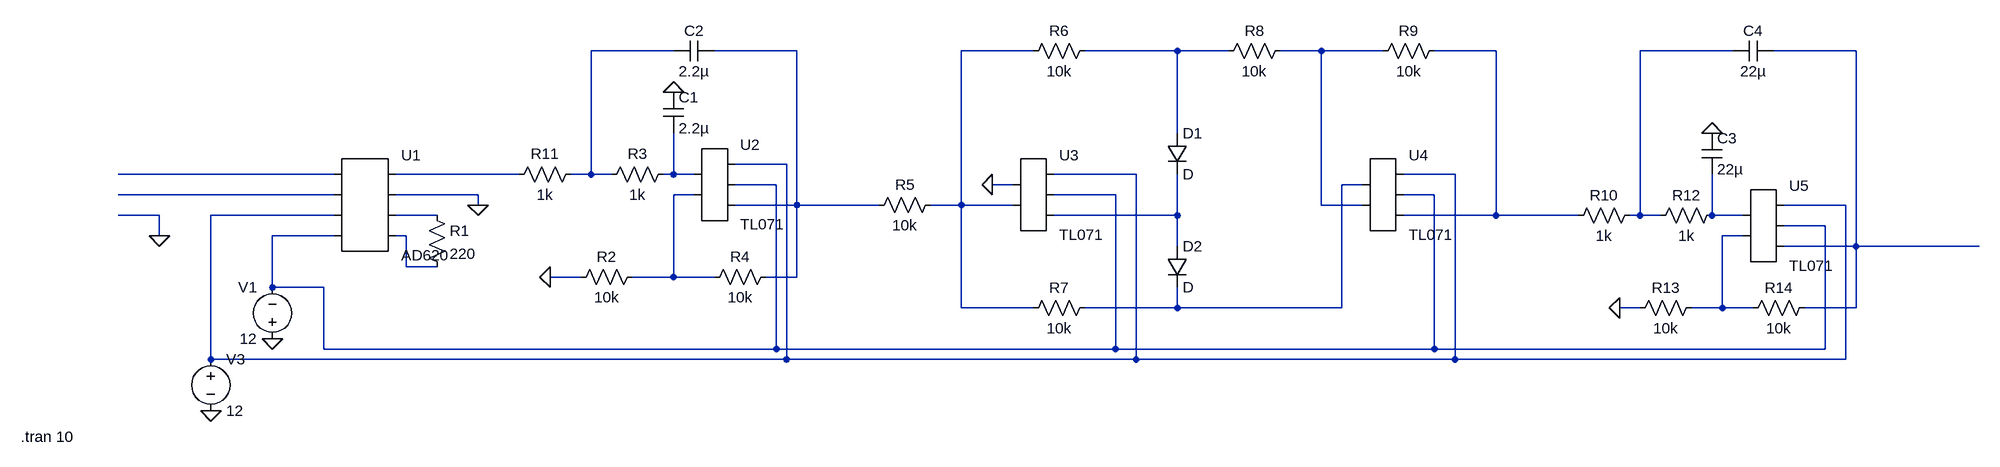
[diagram p0: schematic circuit.asc]
circuit.asc, the LTspice schematic file:
Version 4
SHEET 1 3044 680
WIRE 912 -144 784 -144
WIRE 1104 -144 976 -144
WIRE 1472 -144 1360 -144
WIRE 1696 -144 1552 -144
WIRE 1776 -144 1696 -144
WIRE 1920 -144 1856 -144
WIRE 2016 -144 1920 -144
WIRE 2192 -144 2096 -144
WIRE 2560 -144 2416 -144
WIRE 2752 -144 2624 -144
WIRE 1696 -16 1696 -144
WIRE 1088 32 1008 32
WIRE 384 48 48 48
WIRE 672 48 480 48
WIRE 784 48 784 -144
WIRE 784 48 752 48
WIRE 816 48 784 48
WIRE 912 48 912 -16
WIRE 912 48 896 48
WIRE 944 48 912 48
WIRE 1632 48 1504 48
WIRE 2128 48 2048 48
WIRE 1072 64 1008 64
WIRE 1440 64 1408 64
WIRE 1984 64 1952 64
WIRE 384 80 48 80
WIRE 608 80 480 80
WIRE 944 80 912 80
WIRE 1600 80 1504 80
WIRE 2096 80 2048 80
WIRE 608 96 608 80
WIRE 1104 96 1104 -144
WIRE 1104 96 1008 96
WIRE 1232 96 1104 96
WIRE 1360 96 1360 -144
WIRE 1360 96 1312 96
WIRE 1440 96 1360 96
WIRE 1920 96 1920 -144
WIRE 1984 96 1920 96
WIRE 2736 96 2640 96
WIRE 112 112 48 112
WIRE 384 112 192 112
WIRE 544 112 480 112
WIRE 1696 112 1696 48
WIRE 1696 112 1504 112
WIRE 2192 112 2192 -144
WIRE 2192 112 2048 112
WIRE 2320 112 2192 112
WIRE 2416 112 2416 -144
WIRE 2416 112 2400 112
WIRE 2448 112 2416 112
WIRE 2528 112 2528 48
WIRE 2576 112 2528 112
WIRE 2704 128 2640 128
WIRE 112 144 112 112
WIRE 384 144 288 144
WIRE 496 144 480 144
WIRE 2576 144 2544 144
WIRE 1696 160 1696 112
WIRE 2752 160 2752 -144
WIRE 2752 160 2640 160
WIRE 2944 160 2752 160
WIRE 496 192 496 144
WIRE 544 192 496 192
WIRE 768 208 720 208
WIRE 912 208 912 80
WIRE 912 208 848 208
WIRE 976 208 912 208
WIRE 1104 208 1104 96
WIRE 1104 208 1056 208
WIRE 288 224 288 144
WIRE 368 224 288 224
WIRE 1360 256 1360 96
WIRE 1472 256 1360 256
WIRE 1696 256 1696 224
WIRE 1696 256 1552 256
WIRE 1952 256 1952 64
WIRE 1952 256 1696 256
WIRE 2416 256 2384 256
WIRE 2544 256 2544 144
WIRE 2544 256 2496 256
WIRE 2592 256 2544 256
WIRE 2752 256 2752 160
WIRE 2752 256 2672 256
WIRE 368 320 368 224
WIRE 1072 320 1072 64
WIRE 1072 320 368 320
WIRE 1600 320 1600 80
WIRE 1600 320 1072 320
WIRE 2096 320 2096 80
WIRE 2096 320 1600 320
WIRE 2704 320 2704 128
WIRE 2704 320 2096 320
WIRE 192 336 192 112
WIRE 1088 336 1088 32
WIRE 1088 336 192 336
WIRE 1632 336 1632 48
WIRE 1632 336 1088 336
WIRE 2128 336 2128 48
WIRE 2128 336 1632 336
WIRE 2736 336 2736 96
WIRE 2736 336 2128 336
FLAG 608 96 0
FLAG 288 304 0
FLAG 192 416 0
FLAG 912 -80 0
FLAG 720 208 0
FLAG 1408 64 0
FLAG 2528 -16 0
FLAG 2384 256 0
FLAG 112 144 0
SYMBOL AutoGenerated\\AD620 432 96 R0
SYMATTR InstName U1
SYMBOL res 528 96 R0
SYMATTR InstName R1
SYMATTR Value 220
SYMBOL voltage 288 320 R180
WINDOW 0 24 96 Left 2
WINDOW 3 24 16 Left 2
WINDOW 123 0 0 Left 0
WINDOW 39 0 0 Left 0
SYMATTR InstName V1
SYMATTR Value 12
SYMBOL voltage 192 320 R0
WINDOW 123 0 0 Left 0
WINDOW 39 0 0 Left 0
SYMATTR InstName V3
SYMATTR Value 12
SYMBOL cap 896 -80 R0
SYMATTR InstName C1
SYMATTR Value 2.2µ
SYMBOL res 768 32 R90
WINDOW 0 0 56 VBottom 2
WINDOW 3 32 56 VTop 2
SYMATTR InstName R11
SYMATTR Value 1k
SYMBOL AutoGenerated\\TL071 976 64 R0
SYMATTR InstName U2
SYMBOL res 864 192 R90
WINDOW 0 0 56 VBottom 2
WINDOW 3 32 56 VTop 2
SYMATTR InstName R2
SYMATTR Value 10k
SYMBOL res 1072 192 R90
WINDOW 0 0 56 VBottom 2
WINDOW 3 32 56 VTop 2
SYMATTR InstName R4
SYMATTR Value 10k
SYMBOL res 912 32 R90
WINDOW 0 0 56 VBottom 2
WINDOW 3 32 56 VTop 2
SYMATTR InstName R3
SYMATTR Value 1k
SYMBOL cap 976 -160 R90
WINDOW 0 0 32 VBottom 2
WINDOW 3 32 32 VTop 2
SYMATTR InstName C2
SYMATTR Value 2.2µ
SYMBOL res 1328 80 R90
WINDOW 0 0 56 VBottom 2
WINDOW 3 32 56 VTop 2
SYMATTR InstName R5
SYMATTR Value 10k
SYMBOL res 1568 240 R90
WINDOW 0 0 56 VBottom 2
WINDOW 3 32 56 VTop 2
SYMATTR InstName R7
SYMATTR Value 10k
SYMBOL AutoGenerated\\TL071 1472 80 R0
SYMATTR InstName U3
SYMBOL AutoGenerated\\TL071 2016 80 R0
SYMATTR InstName U4
SYMBOL diode 1680 -16 R0
SYMATTR InstName D1
SYMBOL diode 1680 160 R0
SYMATTR InstName D2
SYMBOL res 2416 96 R90
WINDOW 0 0 56 VBottom 2
WINDOW 3 32 56 VTop 2
SYMATTR InstName R10
SYMATTR Value 1k
SYMBOL res 2544 96 R90
WINDOW 0 0 56 VBottom 2
WINDOW 3 32 56 VTop 2
SYMATTR InstName R12
SYMATTR Value 1k
SYMBOL cap 2512 -16 R0
SYMATTR InstName C3
SYMATTR Value 22µ
SYMBOL AutoGenerated\\TL071 2608 128 R0
SYMATTR InstName U5
SYMBOL cap 2624 -160 R90
WINDOW 0 0 32 VBottom 2
WINDOW 3 32 32 VTop 2
SYMATTR InstName C4
SYMATTR Value 22µ
SYMBOL res 2512 240 R90
WINDOW 0 0 56 VBottom 2
WINDOW 3 32 56 VTop 2
SYMATTR InstName R13
SYMATTR Value 10k
SYMBOL res 2688 240 R90
WINDOW 0 0 56 VBottom 2
WINDOW 3 32 56 VTop 2
SYMATTR InstName R14
SYMATTR Value 10k
SYMBOL res 1568 -160 R90
WINDOW 0 0 56 VBottom 2
WINDOW 3 32 56 VTop 2
SYMATTR InstName R6
SYMATTR Value 10k
SYMBOL res 1872 -160 R90
WINDOW 0 0 56 VBottom 2
WINDOW 3 32 56 VTop 2
SYMATTR InstName R8
SYMATTR Value 10k
SYMBOL res 2112 -160 R90
WINDOW 0 0 56 VBottom 2
WINDOW 3 32 56 VTop 2
SYMATTR InstName R9
SYMATTR Value 10k
TEXT -104 456 Left 2 !.tran 10

The netlist it stands for:
* circuit.asc
* U1: AD620 (symbol AutoGenerated\AD620 not available, pins judged from their places): pin1=N010 pin2=N015 pin3=N009 pin4=N013 pin5=N011 pin6=0 pin7=N017 pin8=N020
R1 N017 N020 220
V1 0 N013 12
V3 N009 0 12
C1 0 N012 2.2µ
R11 N001 N011 1k
* U2: TL071 (symbol AutoGenerated\TL071 not available, pins judged from their places): pin1=N012 pin2=N016 pin3=N009 pin4=N013 pin5=N002
R2 N016 0 10k
R4 N002 N016 10k
R3 N012 N001 1k
C2 N002 N001 2.2µ
R5 N003 N002 10k
R7 N014 N003 10k
* U3: TL071 (symbol AutoGenerated\TL071 not available, pins judged from their places): pin1=0 pin2=N003 pin3=N009 pin4=N013 pin5=N018
* U4: TL071 (symbol AutoGenerated\TL071 not available, pins judged from their places): pin1=N014 pin2=N005 pin3=N009 pin4=N013 pin5=N006
D1 N004 N018 D
D2 N018 N014 D
R10 N007 N006 1k
R12 N019 N007 1k
C3 0 N019 22µ
* U5: TL071 (symbol AutoGenerated\TL071 not available, pins judged from their places): pin1=N019 pin2=N021 pin3=N009 pin4=N013 pin5=N008
C4 N008 N007 22µ
R13 N021 0 10k
R14 N008 N021 10k
R6 N004 N003 10k
R8 N005 N004 10k
R9 N006 N005 10k
.model D D
.lib standard.dio
.tran 10
.backanno
.end